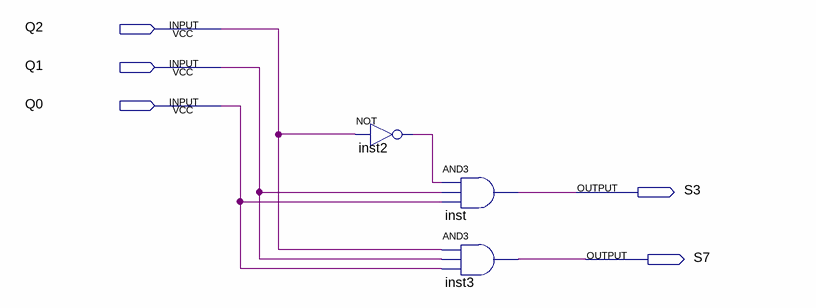
[diagram p0: schematic sheet]
// Quartus schematic CC.bdf as structural Verilog: 3 symbols, 5 pins
module CC (
  input  Q2,
  input  Q1,
  input  Q0,
  output S3,
  output S7
);

  wire inst2_out;

  not inst2 (inst2_out, Q2);
  and inst (S3, inst2_out, Q1, Q0);
  and inst3 (S7, Q2, Q1, Q0);
endmodule
